# EAGLE design Charger Control Board rev4 (EAGLE 9.5.2)

## Sheet 1 of 2: Main
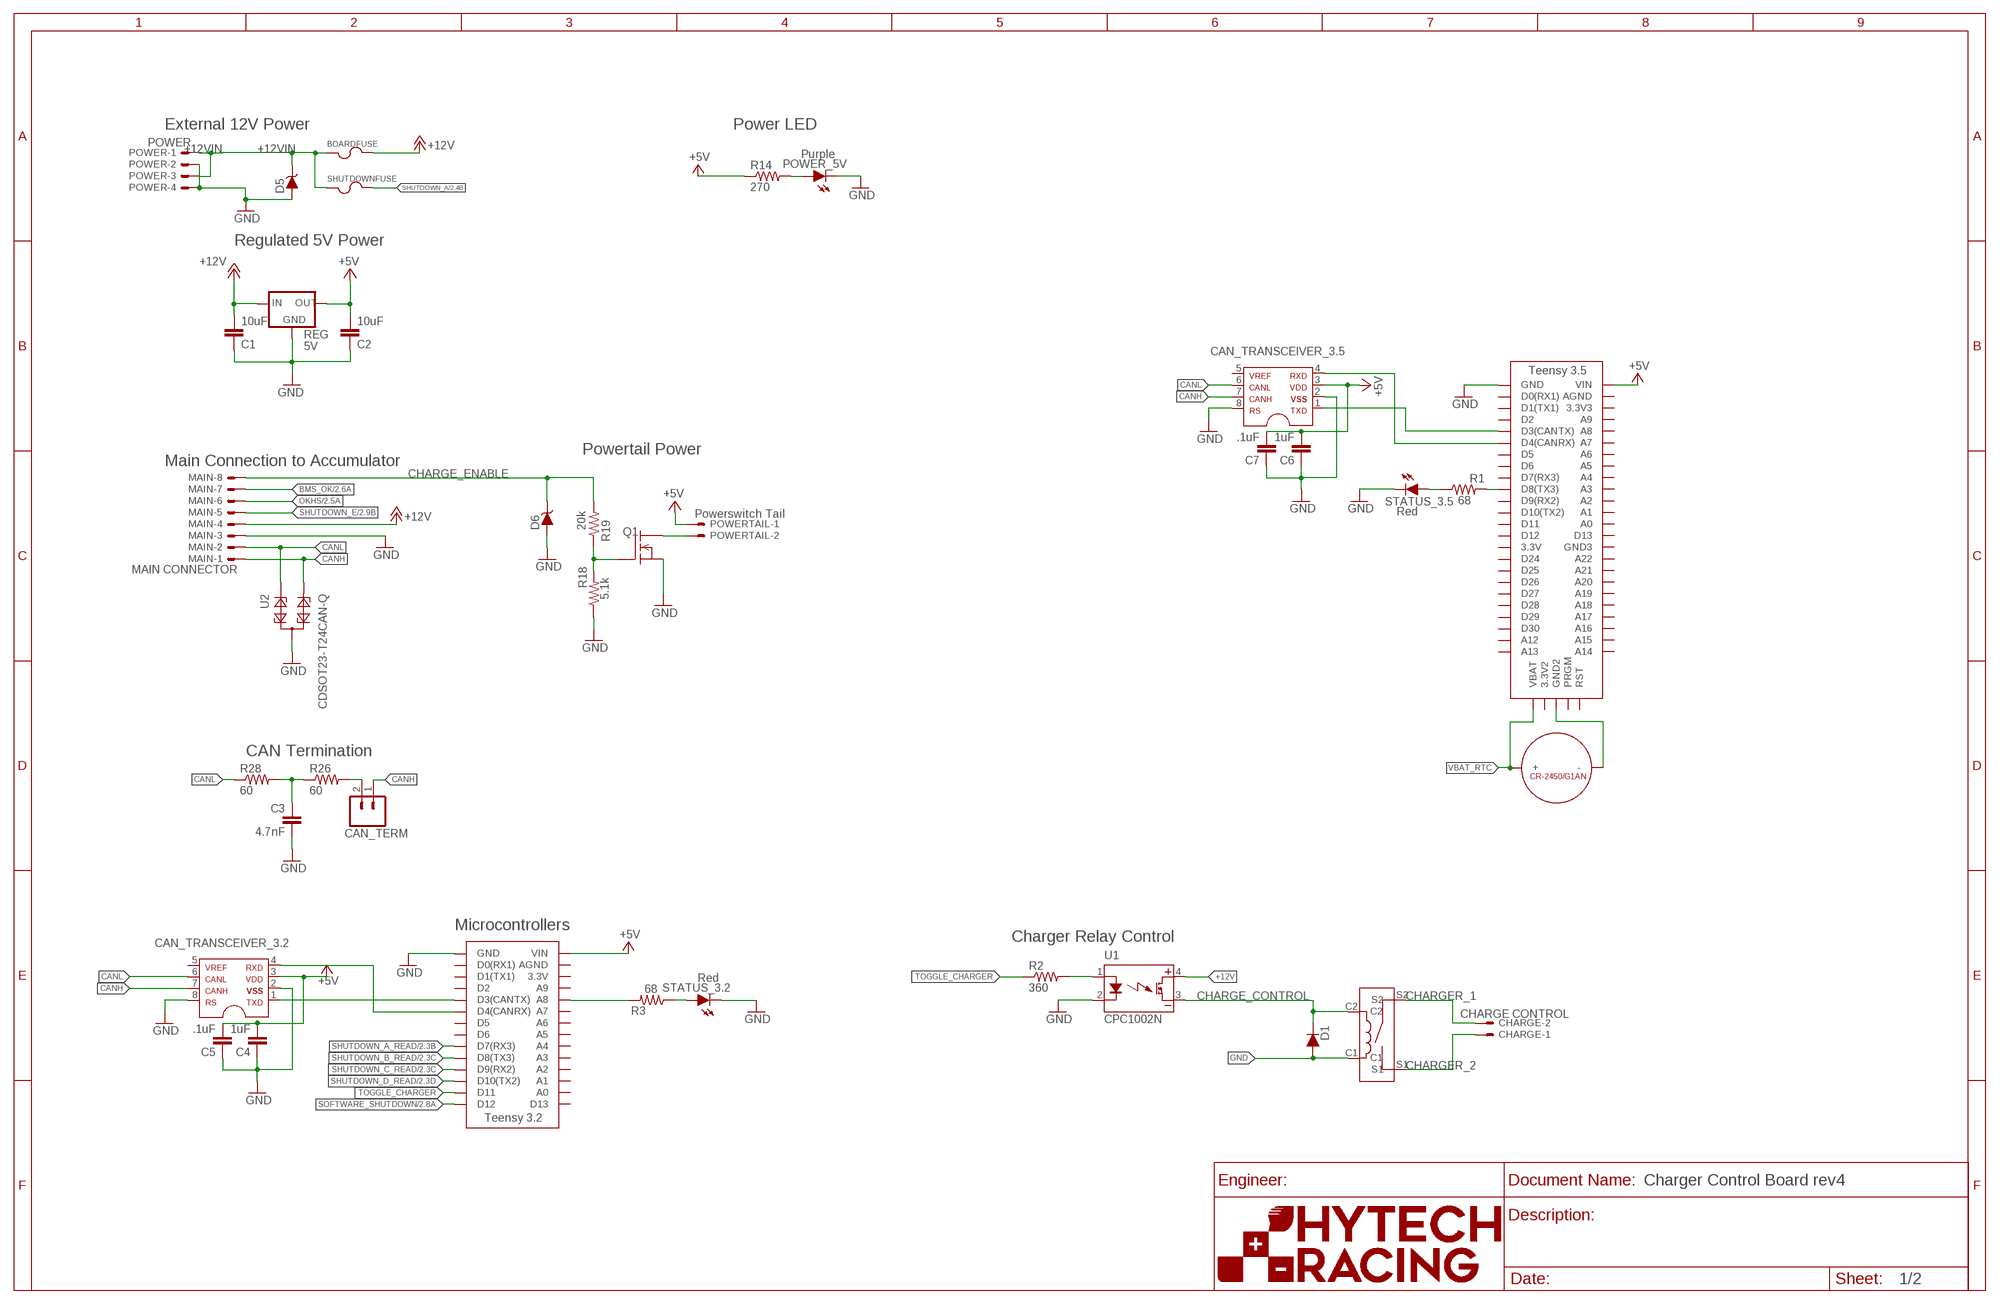
[diagram p0: schematic, sheet 1]
U$6 (FRAME_B_L): ORIENTATION: LANDSCAPE; SIZE: B

### Parts
$$U$3  CR-2450/G1AN  [CR-2450/G1AN]
BOARDFUSE  FUSE_MINIBLADE  [MINI-BLADE_FUSE_HOLDER]
C1  10uF  CAP0603-CAP  [0603-CAP]
C2  10uF  CAP0603-CAP  [0603-CAP]
C3  4.7nF  CAP0603-CAP  [0603-CAP]
C4  1uF  CAP0603-CAP  [0603-CAP]
C5  .1uF  CAP0603-CAP  [0603-CAP]
C6  1uF  CAP0603-CAP  [0603-CAP]
C7  .1uF  CAP0603-CAP  [0603-CAP]
CAN_TERM  M02_SLIM  [1X02_SLIM]
CAN_TRANSCEIVER_3.2  MCP2551  [SOIC-08]
CAN_TRANSCEIVER_3.5  MCP2551  [SOIC-08]
CHARGE  CHARGE CONTROL  CONNECTOR-2NANO-FIT_VERTICAL-2  [NANO-FIT_VERTICAL-2]
D1  DIODE  DIODE0805  [0805_D]
D5  DIODE_ZENER0603  [0603_D]
D6  DIODE_ZENER  [SOT23]
MAIN  MAIN CONNECTOR  CONNECTOR-8NANO-FIT_VERTICAL-8  [NANO-FIT_VERTICAL-8]
POWER  POWER  CONNECTOR-4NANO-FIT-VERTICAL-4  [NANO-FIT_VERTICAL-4]
POWER_5V  Purple  LED-0805  [LED-805]
POWERTAIL  Powerswitch Tail  CONNECTOR-2NANO-FIT_VERTICAL-2  [NANO-FIT_VERTICAL-2]
Q1  DMG3406LSOT  [SOT23]
R1  68  RESISTOR0603-RES  [0603-RES]
R2  360  RESISTOR0603-RES  [0603-RES]
R3  68  RESISTOR0603-RES  [0603-RES]
R14  270  RESISTOR0603-RES  [0603-RES]
R18  5.1k  RESISTOR0603-RES  [0603-RES]
R19  20k  RESISTOR0603-RES  [0603-RES]
R26  60  RESISTOR0603-RES  [0603-RES]
R28  60  RESISTOR0603-RES  [0603-RES]
REG  5V  OKI-78SR-5  [OKI-78SR]
SHUTDOWNFUSE  FUSE_MINIBLADE  [MINI-BLADE_FUSE_HOLDER]
STATUS_3.2  Red  LED-0805  [LED-805]
STATUS_3.5  Red  LED-0805  [LED-805]
U1  CPC1002N  [SOP04]
U2  CDSOT23-T24CAN-Q  [SOT23]
U$3  TEENSY_3.5_EXT_RTC  [TEENSY_3.5_EXT_RTC]
U$4  TEENSY_3.2_SIMPLE  [TEENSY_3.2_SIMPLE]
U$5  KT12-1A-40L-THT  [KT12-1A-40L-THT]

### Nets
+5V: C2.2 C4.2 C5.2 C6.2 C7.2 CAN_TRANSCEIVER_3.2.3 CAN_TRANSCEIVER_3.5.3 POWERTAIL.P$1 R14.1 REG.3(OUT) U$3.VIN U$4.VIN ; also sheet 2
+12V: BOARDFUSE.R1 BOARDFUSE.R2 C1.2 MAIN.P$4 REG.1(IN) U1.4(DC+) ; also sheet 2
+12VIN: BOARDFUSE.L1 BOARDFUSE.L2 D5.C POWER.P$1 POWER.P$3 SHUTDOWNFUSE.L1 SHUTDOWNFUSE.L2
BMS_OK: MAIN.P$7 ; also sheet 2
CANH: CAN_TERM.1 CAN_TRANSCEIVER_3.2.7 CAN_TRANSCEIVER_3.5.7 MAIN.P$1 U2.2
CANL: CAN_TRANSCEIVER_3.2.6 CAN_TRANSCEIVER_3.5.6 MAIN.P$2 R28.1 U2.1
CHARGE_CONTROL: D1.C U1.3(DC-) U$5.C2
CHARGE_ENABLE: D6.3(C) MAIN.P$8 R19.2
CHARGER_1: CHARGE.P$1 U$5.S1
CHARGER_2: CHARGE.P$2 U$5.S2
GND: C1.1 C2.1 C3.2 C4.1 C5.1 C6.1 C7.1 CAN_TRANSCEIVER_3.2.2 CAN_TRANSCEIVER_3.2.8 CAN_TRANSCEIVER_3.5.2 CAN_TRANSCEIVER_3.5.8 D1.A D5.A D6.1(A) MAIN.P$3 POWER.P$2 POWER.P$4 POWER_5V.C Q1.2(S) R18.1 REG.2(GND) STATUS_3.2.C STATUS_3.5.C U1.2(CONTROL-) U2.3 U$3.GND U$4.GND U$5.C1 ; also sheet 2
N$1: POWERTAIL.P$2 Q1.3(D)
N$4: CAN_TRANSCEIVER_3.5.4 U$3.D4(CANRX)
N$5: Q1.1(G) R18.2 R19.1
N$6: CAN_TRANSCEIVER_3.5.1 U$3.D3(CANTX)
N$7: R1.1 STATUS_3.5.A
N$8: R3.1 STATUS_3.2.A
N$9: R1.2 U$3.D8(TX3)
N$10: R2.2 U1.1(CONTROL+)
N$11: R3.2 U$4.A8
N$15: CAN_TRANSCEIVER_3.2.4 U$4.D4(CANRX)
N$17: CAN_TERM.2 R26.2
N$22: CAN_TRANSCEIVER_3.2.1 U$4.D3(CANTX)
N$29: POWER_5V.A R14.2
N$61: $$U$3.- U$3.GND2
N$62: C3.1 R26.1 R28.2
OKHS: MAIN.P$6 ; also sheet 2
SHUTDOWN_A: SHUTDOWNFUSE.R1 SHUTDOWNFUSE.R2 ; also sheet 2
SHUTDOWN_A_READ: U$4.D7(RX3) ; also sheet 2
SHUTDOWN_B_READ: U$4.D8(TX3) ; also sheet 2
SHUTDOWN_C_READ: U$4.D9(RX2) ; also sheet 2
SHUTDOWN_D_READ: U$4.D10(TX2) ; also sheet 2
SHUTDOWN_E: MAIN.P$5 ; also sheet 2
SOFTWARE_SHUTDOWN: U$4.D12 ; also sheet 2
TOGGLE_CHARGER: R2.1 U$4.D11
VBAT_RTC: $$U$3.+_0(+) $$U$3.+_1(+) U$3.VBAT
Unconnected: CAN_TRANSCEIVER_3.2.5 CAN_TRANSCEIVER_3.5.5 U$3.3.3V U$3.3.3V2 U$3.3.3V3 U$3.A0 U$3.A1 U$3.A2 U$3.A3 U$3.A4 U$3.A5 U$3.A6 U$3.A7 U$3.A8 U$3.A9 U$3.A12 U$3.A13 U$3.A14 U$3.A15 U$3.A16 U$3.A17 U$3.A18 U$3.A19 U$3.A20 U$3.A21 U$3.A22 U$3.AGND U$3.D0(RX1) U$3.D1(TX1) U$3.D2 U$3.D5 U$3.D6 U$3.D7(RX3) U$3.D9(RX2) U$3.D10(TX2) U$3.D11 U$3.D12 U$3.D13 U$3.D24 U$3.D25 U$3.D26 U$3.D27 U$3.D28 U$3.D29 U$3.D30 U$3.GND3 U$3.PRGM U$3.RST U$4.3.3V U$4.A0 U$4.A1 U$4.A2 U$4.A3 U$4.A4 U$4.A5 U$4.A6 U$4.A7 U$4.A9 U$4.AGND U$4.D0(RX1) U$4.D1(TX1) U$4.D2 U$4.D5 U$4.D6 U$4.D13

### Notes on the sheet
- External 12V Power | Power LED
- Regulated 5V Power
- Powertail Power
- Main Connection to Accumulator
- CAN Termination
- Microcontrollers
- Charger Relay Control

## Sheet 2 of 2: Shutdown Circuit
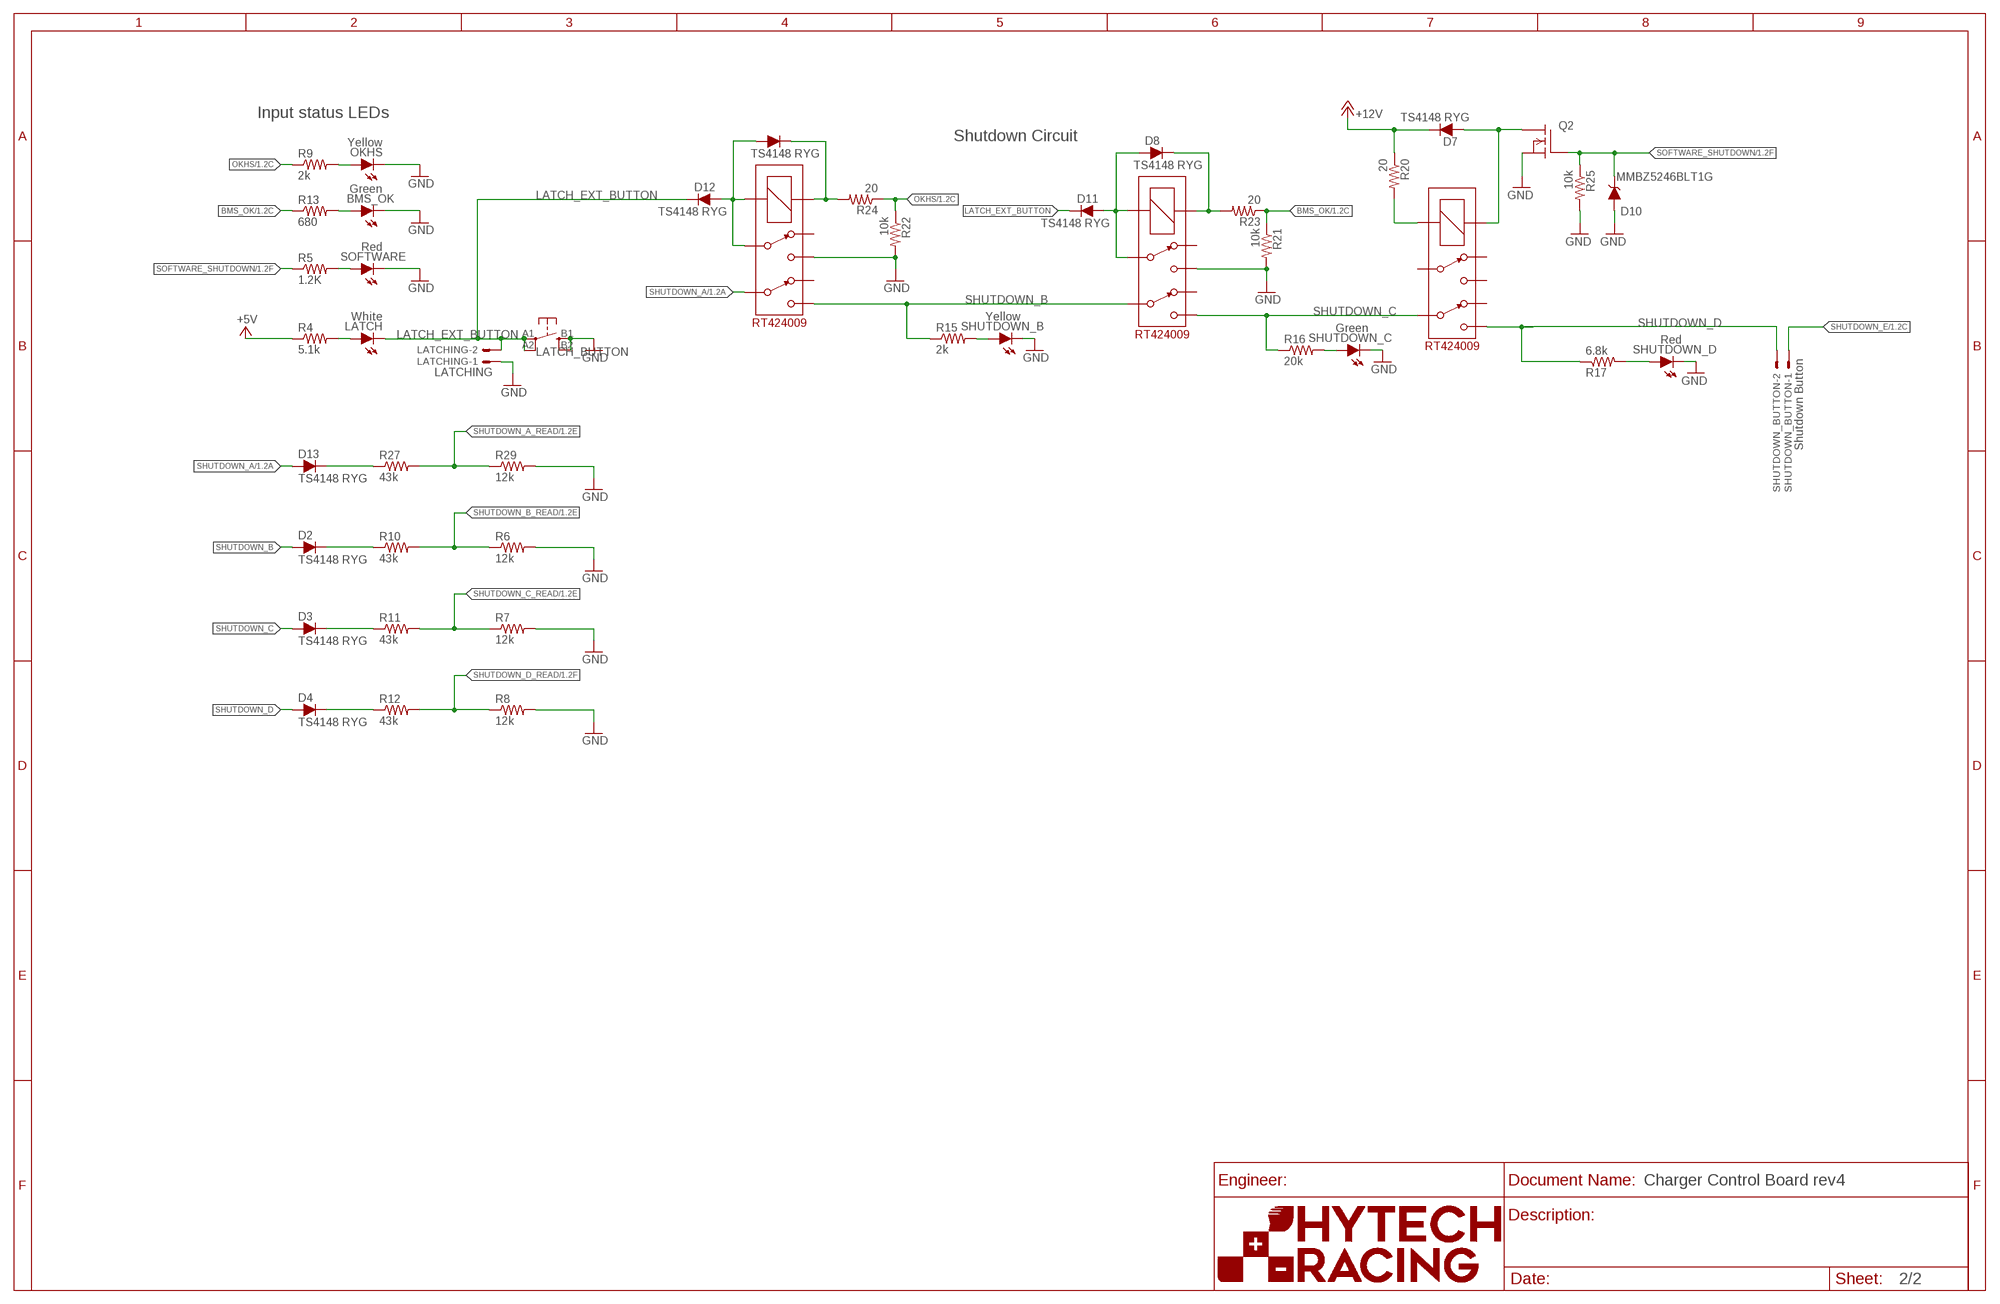
[diagram p1: schematic, sheet 2]
U$7 (FRAME_B_L): ORIENTATION: LANDSCAPE; SIZE: B

### Parts
BMS_OK  Green  LED-0805  [LED-805]
BMS_SHUTDOWN_RLY  RT424009  [RELAY_DPDT]
BMS_SHUTDOWN_RLY1  RT424009  [RELAY_DPDT]
D2  TS4148 RYG  DIODE0805  [0805_D]
D3  TS4148 RYG  DIODE0805  [0805_D]
D4  TS4148 RYG  DIODE0805  [0805_D]
D7  TS4148 RYG  DIODE0805  [0805_D]
D8  TS4148 RYG  DIODE0805  [0805_D]
D9  TS4148 RYG  DIODE0805  [0805_D]
D10  MMBZ5246BLT1G  DIODE_ZENER  [SOT23]
D11  TS4148 RYG  DIODE0805  [0805_D]
D12  TS4148 RYG  DIODE0805  [0805_D]
D13  TS4148 RYG  DIODE0805  [0805_D]
IMD_SHUTDOWN_RLY  RT424009  [RELAY_DPDT]
LATCH  White  LED-0805  [LED-805]
LATCH_BUTTON  BTN_10-XXSMD  [TACTILE_SWITCH_SMD_6.2MM_TALL]
LATCHING  LATCHING  CONNECTOR-2NANO-FIT_VERTICAL-2  [NANO-FIT_VERTICAL-2]
OKHS  Yellow  LED-0805  [LED-805]
Q2  DMG3406LSOT  [SOT23]
R4  5.1k  RESISTOR0603-RES  [0603-RES]
R5  1.2K  RESISTOR0603-RES  [0603-RES]
R6  12k  RESISTOR0603-RES  [0603-RES]
R7  12k  RESISTOR0603-RES  [0603-RES]
R8  12k  RESISTOR0603-RES  [0603-RES]
R9  2k  RESISTOR0603-RES  [0603-RES]
R10  43k  RESISTOR0603-RES  [0603-RES]
R11  43k  RESISTOR0603-RES  [0603-RES]
R12  43k  RESISTOR0603-RES  [0603-RES]
R13  680  RESISTOR0603-RES  [0603-RES]
R15  2k  RESISTOR0603-RES  [0603-RES]
R16  20k  RESISTOR0603-RES  [0603-RES]
R17  6.8k  RESISTOR0603-RES  [0603-RES]
R20  20  RESISTOR0603-RES  [0603-RES]
R21  10k  RESISTOR0603-RES  [0603-RES]
R22  10k  RESISTOR0603-RES  [0603-RES]
R23  20  RESISTOR0603-RES  [0603-RES]
R24  20  RESISTOR0603-RES  [0603-RES]
R25  10k  RESISTOR0603-RES  [0603-RES]
R27  43k  RESISTOR0603-RES  [0603-RES]
R29  12k  RESISTOR0603-RES  [0603-RES]
SHUTDOWN_B  Yellow  LED-0805  [LED-805]
SHUTDOWN_BUTTON  Shutdown Button  CONNECTOR-2NANO-FIT_VERTICAL-2  [NANO-FIT_VERTICAL-2]
SHUTDOWN_C  Green  LED-0805  [LED-805]
SHUTDOWN_D  Red  LED-0805  [LED-805]
SOFTWARE  Red  LED-0805  [LED-805]

### Nets
+5V: R4.1 ; also sheet 1
+12V: D7.C R20.1 ; also sheet 1
BMS_OK: R13.1 R21.1 R23.1 ; also sheet 1
BMS_OK_RELAY: BMS_SHUTDOWN_RLY.COIL+ D8.C R23.2
BMS_PWR_STEP: BMS_SHUTDOWN_RLY.3 BMS_SHUTDOWN_RLY.COIL- D8.A D11.A
GND: BMS_OK.C BMS_SHUTDOWN_RLY.4 D10.1(A) IMD_SHUTDOWN_RLY.4 LATCH_BUTTON.B1(S) LATCH_BUTTON.B2(S1) LATCHING.P$1 OKHS.C Q2.2(S) R6.2 R7.2 R8.2 R21.2 R22.2 R25.2 R29.2 SHUTDOWN_B.C SHUTDOWN_C.C SHUTDOWN_D.C SOFTWARE.C ; also sheet 1
IMD_PWR_STEP: D9.A D12.A IMD_SHUTDOWN_RLY.3 IMD_SHUTDOWN_RLY.COIL-
LATCH_EXT_BUTTON: D11.C D12.C LATCH.C LATCH_BUTTON.A1(P) LATCH_BUTTON.A2(P1) LATCHING.P$2
N$2: LATCH.A R4.2
N$3: BMS_OK.A R13.2
N$12: D9.C IMD_SHUTDOWN_RLY.COIL+ R24.2
N$13: BMS_SHUTDOWN_RLY1.COIL- R20.2
N$14: D13.C R27.1
N$18: D2.C R10.1
N$19: R15.2 SHUTDOWN_B.A
N$20: D3.C R11.1
N$21: D4.C R12.1
N$26: OKHS.A R9.2
N$30: R17.2 SHUTDOWN_D.A
N$31: R5.2 SOFTWARE.A
N$32: R16.2 SHUTDOWN_C.A
N$33: BMS_SHUTDOWN_RLY1.COIL+ D7.A Q2.3(D)
OKHS: R9.1 R22.1 R24.1 ; also sheet 1
SHUTDOWN_A: D13.A IMD_SHUTDOWN_RLY.6 ; also sheet 1
SHUTDOWN_A_READ: R27.2 R29.1 ; also sheet 1
SHUTDOWN_B: BMS_SHUTDOWN_RLY.6 D2.A IMD_SHUTDOWN_RLY.5 R15.1
SHUTDOWN_B_READ: R6.1 R10.2 ; also sheet 1
SHUTDOWN_C: BMS_SHUTDOWN_RLY1.6 BMS_SHUTDOWN_RLY.5 D3.A R16.1
SHUTDOWN_C_READ: R7.1 R11.2 ; also sheet 1
SHUTDOWN_D: BMS_SHUTDOWN_RLY1.5 D4.A R17.1 SHUTDOWN_BUTTON.P$2
SHUTDOWN_D_READ: R8.1 R12.2 ; also sheet 1
SHUTDOWN_E: SHUTDOWN_BUTTON.P$1 ; also sheet 1
SOFTWARE_SHUTDOWN: D10.3(C) Q2.1(G) R5.1 R25.1 ; also sheet 1
Unconnected: BMS_SHUTDOWN_RLY1.2 BMS_SHUTDOWN_RLY1.3 BMS_SHUTDOWN_RLY1.4 BMS_SHUTDOWN_RLY1.7 BMS_SHUTDOWN_RLY.2 BMS_SHUTDOWN_RLY.7 IMD_SHUTDOWN_RLY.2 IMD_SHUTDOWN_RLY.7

### Notes on the sheet
- Input status LEDs
- Shutdown Circuit

## Library data of the parts
$$U$3 = HyTechDevices:CR-2450/G1AN: Panasonic CR2450 Battery through hole.
BMS_OK LATCH OKHS POWER_5V SHUTDOWN_B SHUTDOWN_C SHUTDOWN_D SOFTWARE STATUS_3.2 STATUS_3.5 = HyTechDevices:LED: Light Emitting Diode (LED) Source: Dangerous Prototypes Eagle Library <https://github.com/DangerousPrototypes/Eagle_Part_Library>
BMS_SHUTDOWN_RLY BMS_SHUTDOWN_RLY1 IMD_SHUTDOWN_RLY = HyTechDevices:RT424009: TE/Schrack Double Pull Double Throw Relay 9VDC Datasheet <https://www.mouser.com/datasheet/2/418/NG_DS_RT2_1014-736201.pdf> Product Page <https://www.te.com/usa-en/product-6-1393243-2.html>
BOARDFUSE = HyTechDevices:FUSE: Fuse/Fuseclips Keystone Electronics 3568 Fuse Mouser Part <http://www.mouser.com/ProductDetail/Keystone-Electronics/3568> Datasheet <http://www.mouser.com/ds/2/215/568-742601.pdf> Bussman/Eaton Midget Fuse Clip 1A3400 <http://www.mouser.com/ProductDetail/Bussmann-Eaton/BK-1A3400-09-R/?qs=sGAEpiMZZMuG%252bgnN5hGYGzzlAelq2OxnKqVSMVjq8I4%3d> Schurter 0751.0110 Brass Fuse Clip Datasheet <http://www.mouser.com/ds/2/358/typ_OG__Clip__5x20-2553.pdf>; RATING: 3A
C1 = HyTechDevices:CAP: Capacitor Standard 0603 ceramic capacitor, and 0.1" leaded capacitor.; TOLERANCE: 1%; VOLTAGE: 25V
C2 = HyTechDevices:CAP: Capacitor Standard 0603 ceramic capacitor, and 0.1" leaded capacitor.; TOLERANCE: 5%; VOLTAGE: 25V
C3 = HyTechDevices:CAP: Capacitor Standard 0603 ceramic capacitor, and 0.1" leaded capacitor.; TOLERANCE: 5%; VOLTAGE: 50V
C4-C7 = HyTechDevices:CAP: Capacitor Standard 0603 ceramic capacitor, and 0.1" leaded capacitor.; TOLERANCE: 5%; VOLTAGE: 10V
CAN_TERM = HyTechDevices:M02: Standard 2-pin 0.1" header. NOTES ON THE VARIANTS LOCK and LOCK_LONGPADS... This footprint was designed to help hold the alignment of a through-hole component (i.e. 6-pin header) while soldering it into place. You may notice that each hole has been shifted either up or down by 0.005 of an inch from it's more standard position (which is a perfectly straight line). This slight alteration caused the pins (the squares in the middle) to touch the edges of the holes. Because they are alternating, it causes a "brace" to hold the component in place. 0.005 has proven to be the perfect amount of "off-center" position when using our standard breakaway headers. Although looks a little odd when you look at the bare footprint, once you have a header in there, the alteration is very hard to notice. Also,if you push a header all the way into place, it is covered up entirely on the bottom side. This idea of altering the position of holes to aid alignment will be further integrated into the Sparkfun Library for other footprints. It can help hold any component with 3 or more connection pins. Note: The Sparkfun version includes many other packages including surface mount that may be of future interest. Source: Sparkfun <https://github.com/sparkfun/SparkFun-Eagle-Libraries>
CAN_TRANSCEIVER_3.2 CAN_TRANSCEIVER_3.5 = HyTechDevices:MCP2551: MCP2551 High-Speed CAN Transceiver Product Webpage <https://www.microchip.com/wwwproducts/en/MCP2551> Datasheet <http://ww1.microchip.com/downloads/en/DeviceDoc/21667f.pdf> This device is outdated It is replaced by MCP2561. Comparison Page <https://www.microchip.com/wwwproducts/ProductCompare/MCP2551/MCP2561> Product Webpage <https://www.microchip.com/wwwproducts/en/MCP2561> Datasheet <http://ww1.microchip.com/downloads/en/DeviceDoc/20005167C.pdf>
CHARGE LATCHING POWERTAIL SHUTDOWN_BUTTON = HyTechDevices:CONNECTOR-2: Mini-Fit Junior connector 2 pole Source: http://www.molex.com
D1-D4 D7-D9 D11-D13 = HyTechDevices:DIODE: DIODE general purpose rectifier
D5 D6 D10 = HyTechDevices:DIODE_ZENER: ZENER DIODE
LATCH_BUTTON = HyTechDevices:BTN_10-XX: Small momentary tactile push button
MAIN = HyTechDevices:CONNECTOR-8: Mini-Fit Junior connector 8 pole Source: http://www.molex.com
POWER = HyTechDevices:CONNECTOR-4: Mini-Fit Junior connector 4 pole Source: http://www.molex.com
Q1 Q2 = HyTechDevices:DMG3406L: Generic NPN MOSFET DMG3406L (SOT-23, 2.8 A 30V)
R1-R4 R9 R13-R16 R18-R24 R26 R28 = HyTechDevices:RESISTOR: Resistor Basic schematic elements and footprints for 0603, 1206, and PTH resistors.; TOLERANCE: 1%
R5-R8 R10-R12 R17 R25 R27 R29 = HyTechDevices:RESISTOR: Resistor Basic schematic elements and footprints for 0603, 1206, and PTH resistors.
REG = HyTechDevices:OKI-78SR-5: Murata OKI-78SR 5V 1.5A Non-Isolated Switching Regulator DC/DC - Datasheet <https://power.murata.com/data/power/oki-78sr.pdf>
SHUTDOWNFUSE = HyTechDevices:FUSE: Fuse/Fuseclips Keystone Electronics 3568 Fuse Mouser Part <http://www.mouser.com/ProductDetail/Keystone-Electronics/3568> Datasheet <http://www.mouser.com/ds/2/215/568-742601.pdf> Bussman/Eaton Midget Fuse Clip 1A3400 <http://www.mouser.com/ProductDetail/Bussmann-Eaton/BK-1A3400-09-R/?qs=sGAEpiMZZMuG%252bgnN5hGYGzzlAelq2OxnKqVSMVjq8I4%3d> Schurter 0751.0110 Brass Fuse Clip Datasheet <http://www.mouser.com/ds/2/358/typ_OG__Clip__5x20-2553.pdf>; RATING: 4A
U1 = HyTechDevices:CPC1002N: IXYS Solid State Relay .7A
U2 = HyTechDevices:CDSOT23-T24CAN-Q: CAN Bus dual TVS array for transceiver ESD and surge protection
U$3 = HyTechDevices:TEENSY_3.5_EXT_RTC: Extended version of the Teensy 3.5 board that only uses the 2 main rows of pins, plus the perpendicular row with VBat.
U$4 = HyTechDevices:TEENSY_3.2_SIMPLE: Simple version of the Teensy 3.2 board that only uses the 2 main rows of pins, with no perpendicular row with VBat or inner pins.
U$5 = HyTechDevices:KT12-1A-40L-THT

## Board
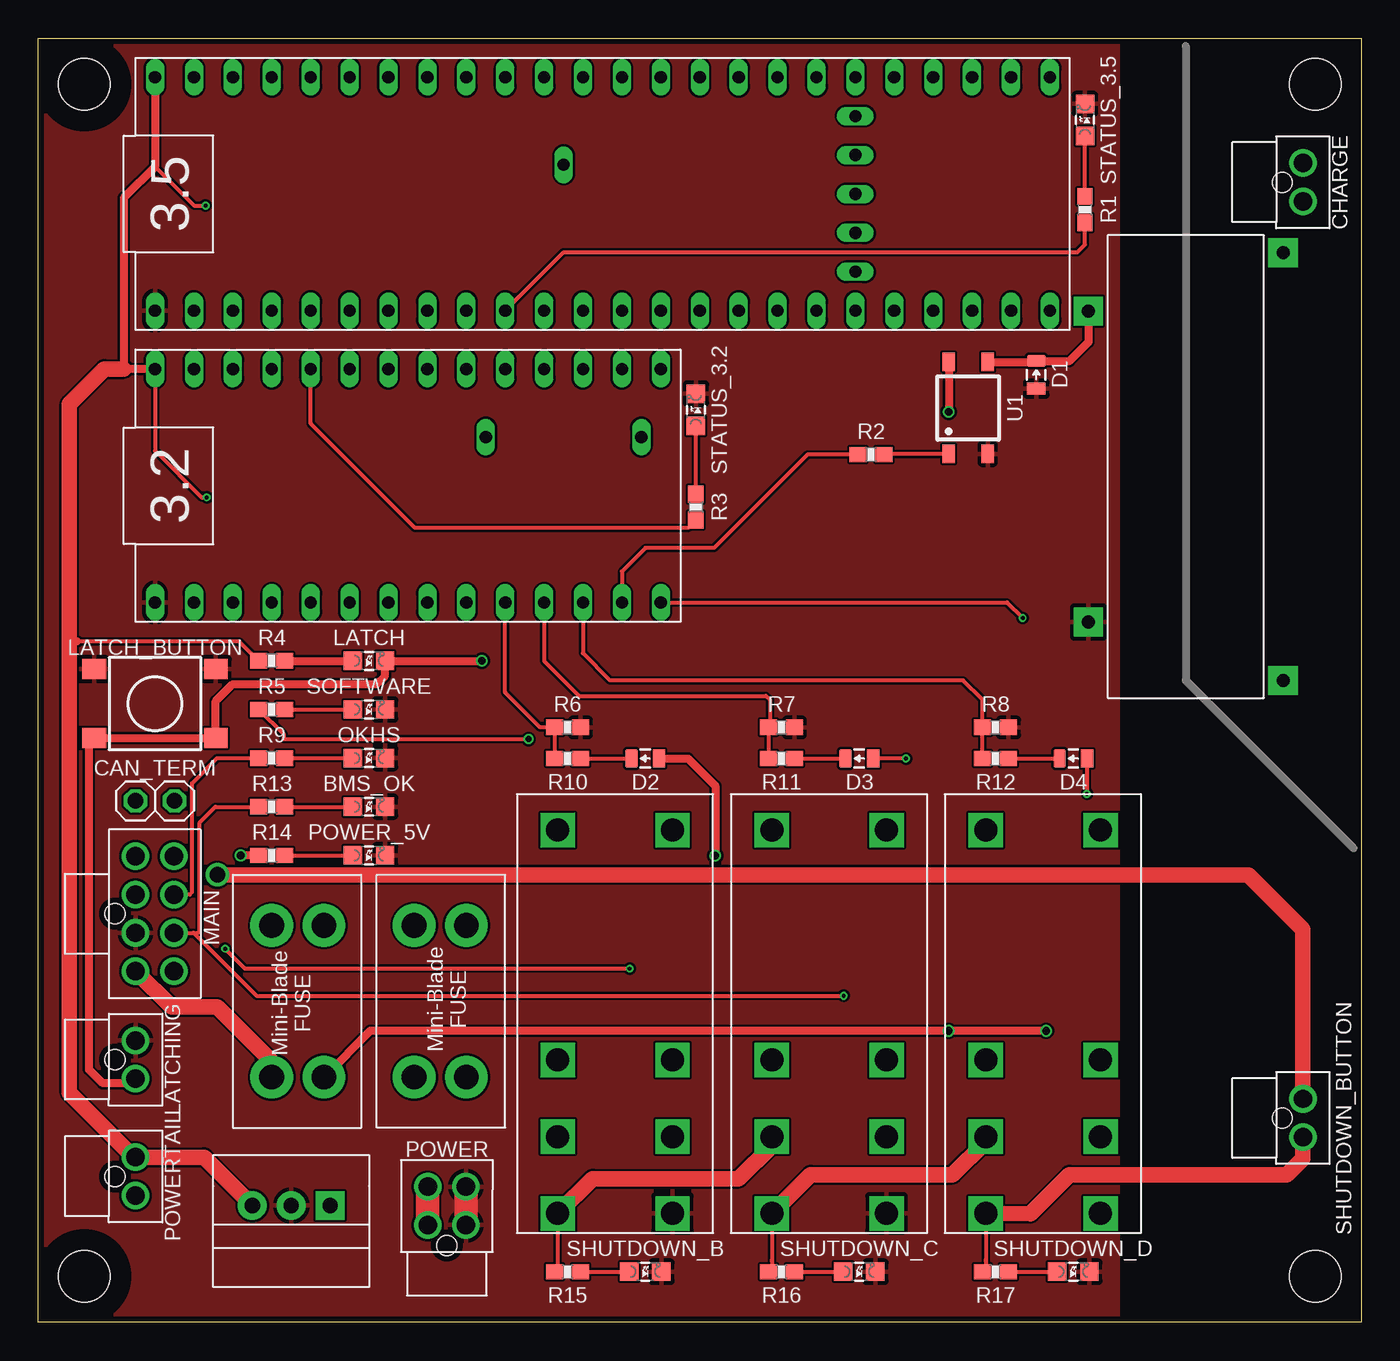
[diagram p2: board, top side]
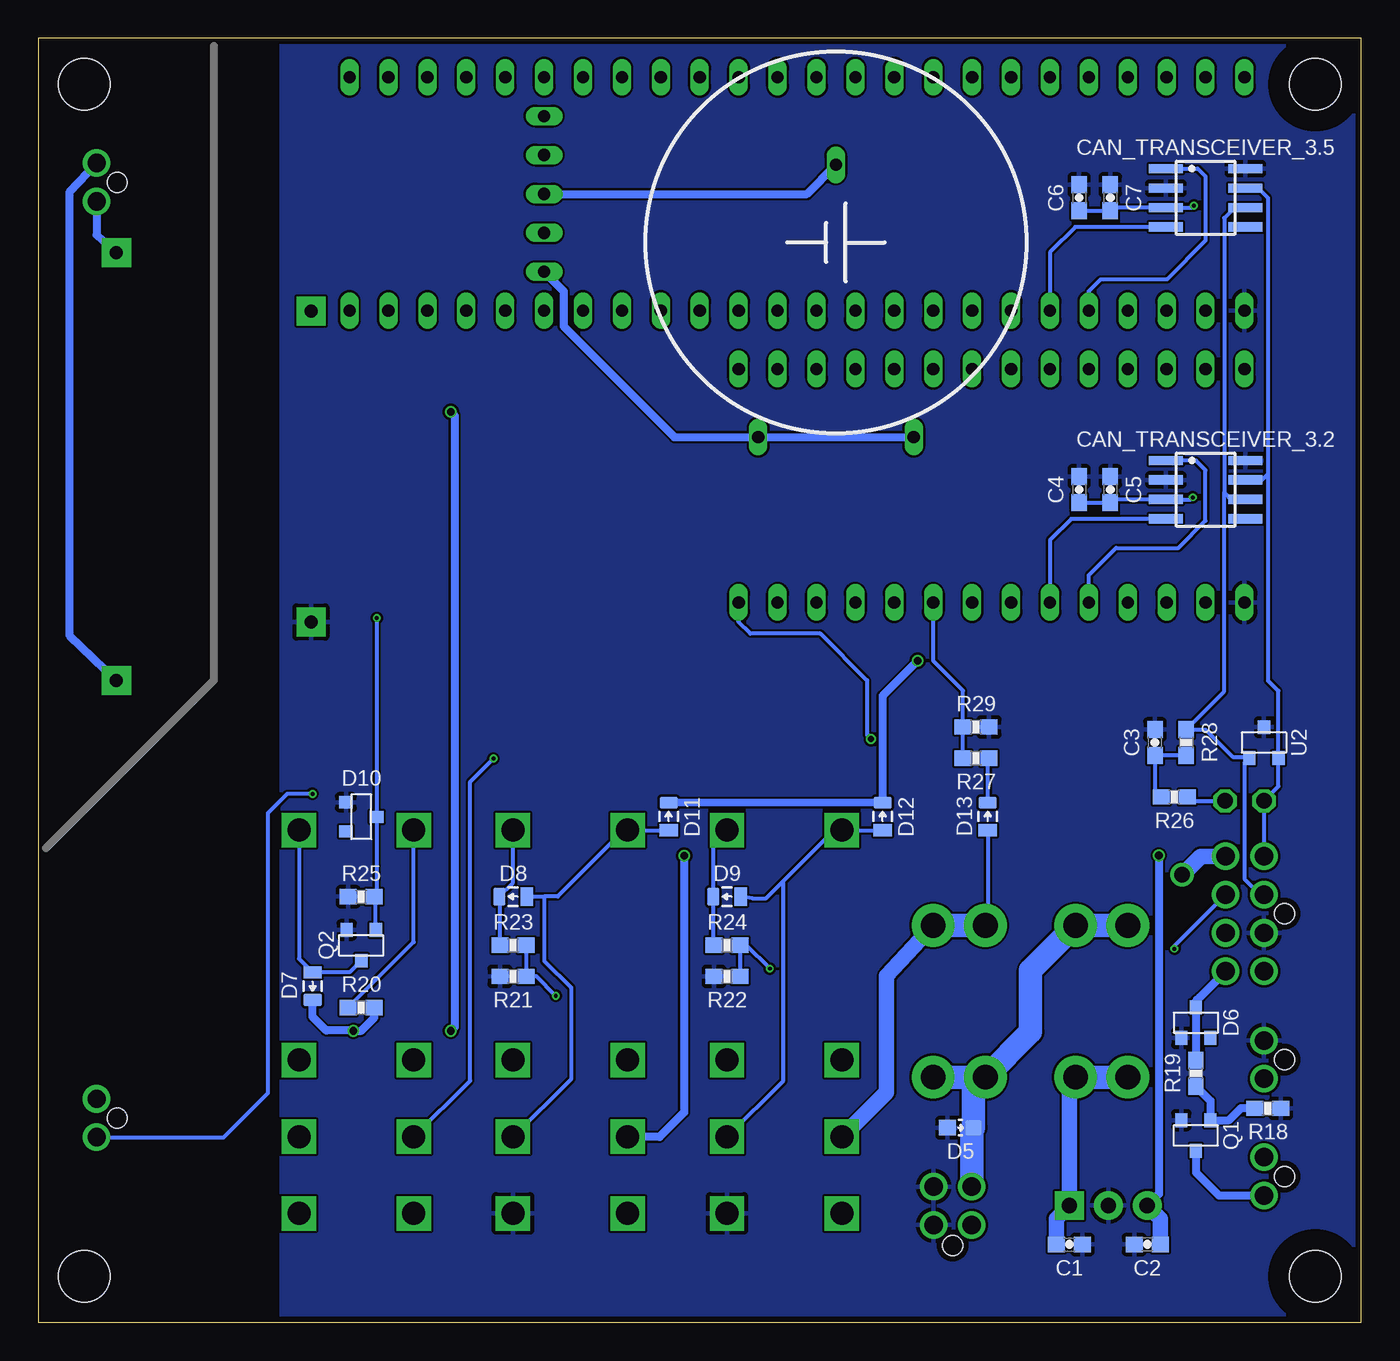
[diagram p3: board, bottom side, seen from below]

Size 86.36 x 83.82 mm. Coordinates in mm from the lower left corner, seen from the top.
Outline: 0,83.82 86.36,83.82 86.36,0 0,0 0,83.82
Copper layers (1*16): Top 0.035559375mm / dielectric 1.6mm / Bottom 0.035559375mm
Design rules "DRC Oshpark": minimum track width 6mil, minimum drill 10mil, track to track 6mil, track to pad 6mil, pad to pad 6mil, via to via 6mil, smd to smd 6mil, copper to edge 15mil, drill to drill 6mil, minimum pad ring 5mil, minimum via ring 5mil, stop-mask expansion 2.5mil, vias tented up to drill 30mil, thermal gap 10mil

### Footprints (pad centres in the part's own frame; a part is rotated, then mirrored left to right if it is on the bottom)
M3_MOUNTING = hole 3.353: 0,0
CR-2450/G1AN = drill 0.8 long: +_0 -5.08,12.7; +_1 5.08,12.7; - 0,-5.08
LED-805 = smd 1.2 x 1.2: A 0,-1.05; C 0,1.05
RELAY_DPDT = drill 1.5 square: 2 10.008,0; 3 5.004,0; 4 0,0; 5 0,7.493; 6 5.004,7.493; 7 10.008,7.493; COIL+ 25.019,0; COIL- 25.019,7.493
MINI-BLADE_FUSE_HOLDER = drill 1.613 pad 2.794: L1 0,3.404; L2 0,0; R1 9.906,3.404; R2 9.906,0
0603-CAP = smd 1.1 x 1: 1 -0.85,0; 2 0.85,0
1X02_SLIM = drill 1.016 octagon: 1 -1.27,0; 2 1.27,0
SOIC-08 = smd 0.6 x 2.2: 1 -1.905,-2.6; 2 -0.635,-2.6; 3 0.635,-2.6; 4 1.905,-2.6; 5 1.905,2.6; 6 0.635,2.6; 7 -0.635,2.6; 8 -1.905,2.6
NANO-FIT_VERTICAL-2 = drill 1.2: P$1 -1.25,0; P$2 1.25,0 | hole 1.3: 0,-1.34
0805_D = smd 0.8 x 1.2: A -0.9,0; C 0.9,0
0603_D = smd 1.1 x 1: A -0.85,0; C 0.85,0
SOT23 = smd 0.8 x 0.9: 1 -0.95,-1; 2 0.95,-1; 3 0,1
TACTILE_SWITCH_SMD_6.2MM_TALL = smd 1.55 x 1.3: A1 -3.975,-2.25; A2 3.975,-2.25; B1 -3.975,2.25; B2 3.975,2.25
NANO-FIT_VERTICAL-8 = drill 1.2: P$1 -3.75,0; P$2 -1.25,0; P$3 1.25,0; P$4 3.75,0; P$5 -3.75,2.5; P$6 -1.25,2.5; P$7 1.25,2.5; P$8 3.75,2.5 | hole 1.3: 0,-1.34
NANO-FIT_VERTICAL-4 = drill 1.2: P$1 -1.25,0; P$2 1.25,0; P$3 -1.25,2.5; P$4 1.25,2.5 | hole 1.3: 0,-1.34
0603-RES = smd 1.1 x 1: 1 -0.85,0; 2 0.85,0
OKI-78SR = drill 1 pad 1.88 square: 1 -2.54,0 | drill 1 pad 1.88: 2 0,0; 3 2.54,0
SOP04 = smd 0.8 x 1.2: 1 -1.27,-3; 2 1.27,-3; 3 1.27,3; 4 -1.27,3
TEENSY_3.5_EXT_RTC = drill 0.8 long: 3.3V 1.27,24.13; 3.3V2 6.35,13.97; 3.3V3 16.51,54.61; A0 16.51,29.21; A1 16.51,31.75; A2 16.51,34.29; A3 16.51,36.83; A4 16.51,39.37; A5 16.51,41.91; A6 16.51,44.45; A7 16.51,46.99; A8 16.51,49.53; A9 16.51,52.07; A12 1.27,3.81; A13 1.27,1.27; A14 16.51,1.27; A15 16.51,3.81; A16 16.51,6.35; A17 16.51,8.89; A18 16.51,11.43; A19 16.51,13.97; A20 16.51,16.51; A21 16.51,19.05; A22 16.51,21.59; AGND 16.51,57.15; D0(RX1) 1.27,57.15; D1(TX1) 1.27,54.61; D2 1.27,52.07; D3(CANTX) 1.27,49.53; D4(CANRX) 1.27,46.99; D5 1.27,44.45; D6 1.27,41.91; D7(RX3) 1.27,39.37; D8(TX3) 1.27,36.83; D9(RX2) 1.27,34.29; D10(TX2) 1.27,31.75; D11 1.27,29.21; D12 1.27,26.67; D13 16.51,26.67; D24 1.27,21.59; D25 1.27,19.05; D26 1.27,16.51; D27 1.27,13.97; D28 1.27,11.43; D29 1.27,8.89; D30 1.27,6.35; GND 1.27,59.69; GND2 8.89,13.97; GND3 16.51,24.13; PRGM 11.43,13.97; RST 13.97,13.97; VBAT 3.81,13.97; VIN 16.51,59.69
TEENSY_3.2_SIMPLE = drill 0.8 long: 3.3V 16.51,29.21; A0 16.51,3.81; A1 16.51,6.35; A2 16.51,8.89; A3 16.51,11.43; A4 16.51,13.97; A5 16.51,16.51; A6 16.51,19.05; A7 16.51,21.59; A8 16.51,24.13; A9 16.51,26.67; AGND 16.51,31.75; D0(RX1) 1.27,31.75; D1(TX1) 1.27,29.21; D2 1.27,26.67; D3(CANTX) 1.27,24.13; D4(CANRX) 1.27,21.59; D5 1.27,19.05; D6 1.27,16.51; D7(RX3) 1.27,13.97; D8(TX3) 1.27,11.43; D9(RX2) 1.27,8.89; D10(TX2) 1.27,6.35; D11 1.27,3.81; D12 1.27,1.27; D13 16.51,1.27; GND 1.27,34.29; VIN 16.51,34.29
KT12-1A-40L-THT = drill 0.85 pad 1.9 square: C1 4.95,11.45; C2 25.25,11.45; S1 1.13,-1.25; S2 29.07,-1.25

### Placement (x,y rotation side)
$$U$1  [M3_MOUNTING]  3,3 0 top
$$U$2  [M3_MOUNTING]  83.36,3 0 top
$$U$3  34.29,70.48 180 bottom
BMS_OK  21.59,33.66 270 top
BMS_SHUTDOWN_RLY  55.37,7.11 90 top
BMS_SHUTDOWN_RLY1  69.34,7.11 90 top
BOARDFUSE  15.24,25.91 270 top
C1  19.05,5.08 180 bottom
C2  13.97,5.08 0 bottom
C3  13.46,37.85 90 bottom
C4  18.41,54.36 270 bottom
C5  16.38,54.36 270 bottom
C6  18.41,73.41 270 bottom
C7  16.38,73.41 270 bottom
CAN_TERM  7.62,34.04 0 top
CAN_TRANSCEIVER_3.2  10.16,54.36 270 bottom
CAN_TRANSCEIVER_3.5  10.16,73.41 270 bottom
CHARGE  82.55,74.42 270 top
D1  65.15,61.85 90 top
D2  39.62,36.8 180 top
D3  53.59,36.8 180 top
D4  67.56,36.8 180 top
D5  26.16,12.7 0 bottom
D6  10.79,19.56 0 bottom
D7  68.45,21.95 270 bottom
D8  55.37,27.79 180 bottom
D9  41.4,27.79 180 bottom
D10  65.28,32.99 270 bottom
D11  45.21,33.02 90 bottom
D12  31.24,33.02 90 bottom
D13  24.38,33.02 90 bottom
IMD_SHUTDOWN_RLY  41.4,7.11 90 top
LATCH  21.59,43.18 270 top
LATCH_BUTTON  7.62,40.39 0 top
LATCHING  6.35,17.14 270 top
MAIN  6.35,26.67 270 top
OKHS  21.59,36.83 270 top
POWER  26.67,6.35 0 top
POWER_5V  21.59,30.48 270 top
POWERTAIL  6.35,9.53 270 top
Q1  10.79,12.19 180 bottom
Q2  65.28,24.61 180 bottom
R1  68.33,72.64 270 top
R2  54.36,56.64 0 top
R3  42.93,53.21 270 top
R4  15.24,43.18 0 top
R5  15.24,40.01 0 top
R6  34.54,38.84 0 top
R7  48.51,38.84 0 top
R8  62.48,38.84 0 top
R9  15.24,36.83 0 top
R10  34.54,36.8 180 top
R11  48.51,36.8 180 top
R12  62.48,36.8 180 top
R13  15.24,33.66 0 top
R14  15.24,30.48 0 top
R15  34.54,3.3 0 top
R16  48.51,3.3 0 top
R17  62.48,3.3 0 top
R18  6.1,13.97 180 bottom
R19  10.79,16.26 90 bottom
R20  65.28,20.55 180 bottom
R21  55.37,22.58 180 bottom
R22  41.4,22.58 180 bottom
R23  55.37,24.61 180 bottom
R24  41.4,24.61 180 bottom
R25  65.28,27.79 180 bottom
R26  12.19,34.29 0 bottom
R27  25.15,36.83 180 bottom
R28  11.43,37.85 270 bottom
R29  25.15,38.86 0 bottom
REG  16.51,7.62 180 top
SHUTDOWN_B  39.62,3.3 270 top
SHUTDOWN_BUTTON  82.55,13.34 270 top
SHUTDOWN_C  53.59,3.3 270 top
SHUTDOWN_D  67.56,3.3 270 top
SHUTDOWNFUSE  27.94,16 90 top
SOFTWARE  21.59,40.01 270 top
STATUS_3.2  42.93,59.56 0 top
STATUS_3.5  68.33,78.49 0 top
U1  60.71,59.69 0 top
U2  6.35,37.85 0 bottom
U$1  [M3_MOUNTING]  3,80.82 0 top
U$2  [M3_MOUNTING]  83.36,80.82 0 top
U$3  67.31,64.77 90 top
U$4  41.91,45.72 90 top
U$5  80.01,40.77 90 top

### Tracks (layer width: path | path; a pad name or v marks a point on that pad's centre or on a via)
+5V  (via drill 0.25, 0.51)
  Top 0.254: U$4.VIN 7.62,56.9 10.67,53.85 v10.99,53.85 | 7.62,75.44 10.16,72.9 v10.92,72.9 | R4.1 13.12,44.45 2.54,44.45
  Top 0.508: U$4.VIN 5.59,62.23 5.59,73.41 7.62,75.44 U$3.VIN | 2.03,59.94 2.03,44.45 | 2.03,44.45 2.03,44.2 | 2.54,44.45 2.03,44.45 | R14.1 v13.21,30.48
  Top 1.016: REG.3 10.81,10.78 POWERTAIL.P$1 6.24,10.78 2.03,14.99 2.03,44.2 2.03,59.94 4.32,62.23 5.59,62.23
  Bottom 0.254: C6.2 16.51,72.56 | 16.51,72.56 C7.2 | 16.51,72.56 16.3,72.77 CAN_TRANSCEIVER_3.5.3 11.05,72.77 v10.92,72.9 | C4.2 C5.2 16.17,53.72 CAN_TRANSCEIVER_3.2.3 11.12,53.72 v10.99,53.85
  Bottom 0.508: v13.21,30.48 13.21,8.38 REG.3
  Bottom 1.016: REG.3 13.12,6.77 C2.2
+12V  (via drill 0.51)
  Top 0.508: v65.79,19.02 v59.44,19.02 21.67,19.02 BOARDFUSE.R1 | U1.4 v59.44,59.44
  Top 1.016: MAIN.P$4 8.7,20.57 11.68,20.57 15.24,17.02 BOARDFUSE.R2
  Bottom 0.508: v59.44,59.44 59.18,59.18 59.18,19.28 v59.44,19.02 | R20.1 64.43,19.88 65.28,19.02 v65.79,19.02 65.81,19.05 67.56,19.05 68.45,19.94 D7.C
  Bottom 1.016: C1.2 19.9,6.77 REG.1 19.05,15.6 BOARDFUSE.R1
  Bottom 1.524: BOARDFUSE.R1 BOARDFUSE.R2
+12VIN
  Top 1.524: POWER.P$1 POWER.P$3
  Bottom 1.524: SHUTDOWNFUSE.L1 21.59,18.95 21.59,22.96 BOARDFUSE.L1 BOARDFUSE.L2 | POWER.P$3 25.42,12.59 D5.C 25.31,15.23 SHUTDOWNFUSE.L1 | SHUTDOWNFUSE.L1 SHUTDOWNFUSE.L2
BMS_OK  (via drill 0.25)
  Top 0.254: R13.1 11.56,33.66 10.54,32.64 10.54,25.53 10.43,25.42 MAIN.P$7 10.14,25.42 14.25,21.31 v52.58,21.31
  Bottom 0.254: R23.1 R21.1 53.85,22.58 v52.58,21.31
BMS_OK_RELAY
  Bottom 0.254: R23.2 56.22,27.61 D8.C 55.37,28.69 BMS_SHUTDOWN_RLY.COIL+
BMS_PWR_STEP
  Bottom 0.254: BMS_SHUTDOWN_RLY.3 51.56,15.9 51.56,21.82 53.34,23.6 53.34,27.79 | D8.A 53.34,27.79 | 53.34,27.79 52.45,27.79 48.11,32.13 BMS_SHUTDOWN_RLY.COIL- 47.87,32.12 D11.A
CANH
  Bottom 0.254: 6.1,55.37 6.1,73.41 6.73,74.04 CAN_TRANSCEIVER_3.5.7 | CAN_TRANSCEIVER_3.2.7 6.48,54.99 6.1,55.37 | 6.1,55.37 6.1,41.91 5.4,41.21 U2.2 5.4,34.99 CAN_TERM.1 MAIN.P$1
CANL
  Bottom 0.254: CAN_TRANSCEIVER_3.2.6 8.51,53.72 8.94,54.15 | CAN_TRANSCEIVER_3.5.6 8.26,72.77 8.94,72.09 8.94,54.15 | MAIN.P$2 6.58,27.92 7.62,28.96 7.62,36.53 U2.1 7.33,36.87 8.34,36.87 10.16,38.7 R28.1 8.94,41.19 8.94,54.15
CHARGE_CONTROL
  Top 0.254: 65.13,62.69 D1.C
  Top 0.508: U1.3 65.13,62.69 | U$5.C2 68.56,63.99 67.32,62.75 D1.C
CHARGE_ENABLE
  Bottom 0.508: MAIN.P$8 10.55,21.22 10.79,20.98 D6.3 10.79,19.56 R19.2
CHARGER_1
  Bottom 0.508: CHARGE.P$1 84.33,73.77 84.33,44.84 U$5.S1
CHARGER_2
  Bottom 0.508: CHARGE.P$2 82.55,71 U$5.S2
GND
  Top 1.524: POWER.P$2 POWER.P$4
  pour Top: 70.48,83.82 70.48,0 0,0 0,83.82
  pour Bottom: 0,83.82 70.48,83.82 70.48,0 0,0
IMD_PWR_STEP
  Bottom 0.254: 37.72,28.8 38.85,27.67 39.75,27.67 D9.A | IMD_SHUTDOWN_RLY.3 37.72,15.77 37.72,28.8 | D12.A 33.9,32.12 IMD_SHUTDOWN_RLY.COIL- 34.39,32.13 37.72,28.8
LATCH_EXT_BUTTON  (via drill 0.51)
  Top 0.508: LATCHING.P$2 6.06,15.61 4.21,15.61 3.3,16.51 3.3,37.79 LATCH_BUTTON.A1 LATCH_BUTTON.A2 11.6,40.55 12.7,41.66 22.1,41.66 22.64,42.2 LATCH.C v28.96,43.18
  Bottom 0.508: v28.96,43.18 31.24,40.89 D12.C 31.27,33.9 D11.C
N$1
  Bottom 0.508: POWERTAIL.P$2 9.29,8.28 10.79,9.78 Q1.3
N$2
  Top 0.508: R4.2 LATCH.A
N$3
  Top 0.254: R13.2 BMS_OK.A
N$4
  Bottom 0.254: CAN_TRANSCEIVER_3.5.4 18.67,71.5 20.32,69.85 U$3.D4(CANRX)
N$5
  Bottom 0.508: R19.1 9.85,14.46 Q1.1 8.64,13.19 7.86,13.97 R18.2
N$6
  Bottom 0.254: U$3.D3(CANTX) 17.78,67.31 17.02,68.07 12.7,68.07 10.16,70.61 10.16,74.8 10.67,75.31 CAN_TRANSCEIVER_3.5.1
N$7
  Top 0.254: R1.1 STATUS_3.5.A
N$8
  Top 0.254: R3.1 STATUS_3.2.A
N$9
  Top 0.254: U$3.D8(TX3) 34.29,69.85 67.82,69.85 68.33,70.36 R1.2
N$10
  Top 0.254: U1.1 55.25,56.69 R2.2
N$11
  Top 0.254: R3.2 42.42,51.85 24.6,51.85 17.78,58.67 U$4.A8
N$12
  Bottom 0.254: IMD_SHUTDOWN_RLY.COIL+ 42.3,31.21 D9.C 42.3,24.66 R24.2
N$13
  Bottom 0.254: BMS_SHUTDOWN_RLY1.COIL- 61.85,24.83 R20.2
N$14
  Bottom 0.254: D13.C 24.38,36.74 R27.1
N$15
  Bottom 0.254: CAN_TRANSCEIVER_3.2.4 18.92,52.45 20.32,51.05 U$4.D4(CANRX)
N$17
  Bottom 0.254: R26.2 11.09,34.04 CAN_TERM.2
N$18
  Top 0.254: R10.1 D2.C
N$19
  Top 0.254: R15.2 SHUTDOWN_B.A
N$20
  Top 0.254: R11.1 D3.C
N$21
  Top 0.254: R12.1 D4.C
N$22
  Bottom 0.254: U$4.D3(CANTX) 17.78,48.77 16,50.55 11.94,50.55 10.16,52.32 10.16,55.63 10.79,56.26 CAN_TRANSCEIVER_3.2.1
N$26
  Top 0.254: R9.2 OKHS.A
N$29
  Top 0.254: R14.2 POWER_5V.A
N$30
  Top 0.254: R17.2 SHUTDOWN_D.A
N$31
  Top 0.254: R5.2 SOFTWARE.A
N$32
  Top 0.254: R16.2 SHUTDOWN_C.A
N$33
  Bottom 0.254: Q2.3 66.05,22.85 D7.A 69.34,23.73 BMS_SHUTDOWN_RLY1.COIL+
N$61
  Bottom 0.508: U$3.GND2 36.2,73.66 $$U$3.-
N$62
  Bottom 0.254: R28.2 C3.1 13.46,34.71 R26.1
OKHS  (via drill 0.25)
  Top 0.254: MAIN.P$6 9.89,27.92 10.03,28.07 10.03,35.18 11.68,36.83 R9.1 | v12.19,24.38 13.49,23.09 v38.61,23.09
  Bottom 0.254: MAIN.P$6 12.19,24.58 v12.19,24.38 | R22.1 R24.1 40.13,24.61 v38.61,23.09
SHUTDOWN_A
  Bottom 0.254: SHUTDOWNFUSE.R1 24.38,26.06 D13.A
  Bottom 1.016: SHUTDOWNFUSE.R2 30.99,22.61 30.99,15.01 IMD_SHUTDOWN_RLY.6
  Bottom 1.524: SHUTDOWNFUSE.R2 SHUTDOWNFUSE.R1
SHUTDOWN_A_READ
  Bottom 0.254: R27.2 R29.1 26,41.24 27.94,43.18 U$4.D7(RX3)
SHUTDOWN_B  (via drill 0.51)
  Top 0.254: R15.1 33.91,3.52 IMD_SHUTDOWN_RLY.5
  Top 0.508: v44.2,30.45 44.2,35.03 42.42,36.8 D2.A
  Top 1.016: IMD_SHUTDOWN_RLY.5 36.2,9.37 45.72,9.37 47.88,11.53 BMS_SHUTDOWN_RLY.6
  Bottom 0.508: v44.2,30.45 44.2,13.69 45.8,12.09 BMS_SHUTDOWN_RLY.6
SHUTDOWN_B_READ
  Top 0.254: R10.2 R6.1 32.77,38.84 30.48,41.12 U$4.D8(TX3)
SHUTDOWN_C  (via drill 0.25)
  Top 0.254: BMS_SHUTDOWN_RLY.5 47.88,4.06 47.88,4 47.88,3.52 R16.1 | v56.64,36.8 D3.A
  Top 1.016: BMS_SHUTDOWN_RLY.5 50.42,9.63 59.69,9.63 61.85,11.79 BMS_SHUTDOWN_RLY1.6
  Bottom 0.254: BMS_SHUTDOWN_RLY1.6 58.17,15.77 58.17,35.28 v56.64,36.8
SHUTDOWN_C_READ
  Top 0.254: R11.2 R7.1 47.75,38.92 47.75,40.64 47.5,40.89 35.31,40.89 33.02,43.18 U$4.D9(RX2)
SHUTDOWN_D  (via drill 0.25)
  Top 0.254: BMS_SHUTDOWN_RLY1.5 61.85,4.06 61.85,4 61.85,3.52 R17.1 | D4.A v68.45,34.49
  Top 1.016: BMS_SHUTDOWN_RLY1.5 64.77,7.09 67.31,9.63 81.51,9.63 82.55,10.67 SHUTDOWN_BUTTON.P$2
  Bottom 0.254: v68.45,34.49 70.1,34.49 71.37,33.22 71.37,14.96 74.28,12.06 82.53,12.06 SHUTDOWN_BUTTON.P$2
SHUTDOWN_D_READ
  Top 0.254: R12.2 R8.1 61.63,40.64 60.36,41.91 37.34,41.91 35.56,43.69 U$4.D10(TX2)
SHUTDOWN_E  (via drill 1.02)
  Top 1.016: SHUTDOWN_BUTTON.P$1 82.55,25.65 78.99,29.21 v11.68,29.21
  Bottom 1.016: MAIN.P$5 10.47,30.42 v11.68,29.21
SOFTWARE_SHUTDOWN  (via drill 0.25, 0.38)
  Top 0.254: U$4.D12 63.25,46.99 v64.26,45.97 | R5.1 16,38.39 16,38.08 v32,38.08
  Bottom 0.254: 64.34,28 64.28,28.07 D10.3 64.28,45.96 v64.26,45.97 | 64.34,28 R25.1 | Q2.1 64.33,27.98 64.34,28 | v32,38.08 32.26,38.33 32.26,41.91 35.31,44.96 39.88,44.96 40.64,45.72 U$4.D12
TOGGLE_CHARGER
  Top 0.254: R2.1 50.2,56.64 44.11,50.55 39.62,50.55 38.1,49.02 U$4.D11
VBAT_RTC
  Bottom 0.508: $$U$3.+_0 $$U$3.+_1 44.83,57.78 52.07,65.02 52.07,67.31 U$3.VBAT

### Text on the board
tDocu: GLV | GLV | TS | 2020 Charger Control Board rev4 / Designed by Arvind Srinivasan, Yvonne Yeh | GLV | TS | GLV | TS | TS | GLV
bDocu: GLV | TS | GLV | TS | GLV | TS | TS | GLV